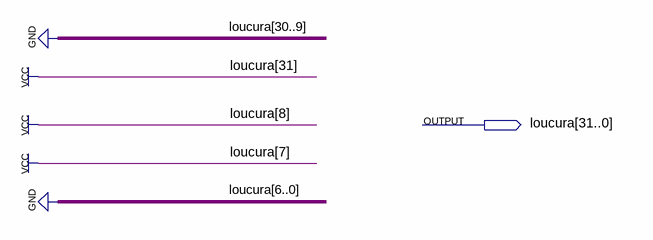
[diagram p0: schematic sheet]
// Quartus schematic loucura.bdf as structural Verilog: 0 symbols, 1 pins
module loucura (
  output [31:0] loucura
);


  assign loucura = 32'b10000000000000000000000110000000;
endmodule
